# Altium schematic sheet ifamp.SchDoc: IF Amp
size Letter; CheckedBy: J. Brinton; CompanyName: Signal Laboratories, Inc.; DrawnBy: J. Brinton; Engineer: J. Brinton; Address1: 3479 Edison Way; Address2: Menlo Park CA 94025; Address3: +1 (877) 778-8435; Address4: siglabs.com; Revision: 3; SheetNumber: 14; SheetTotal: 45
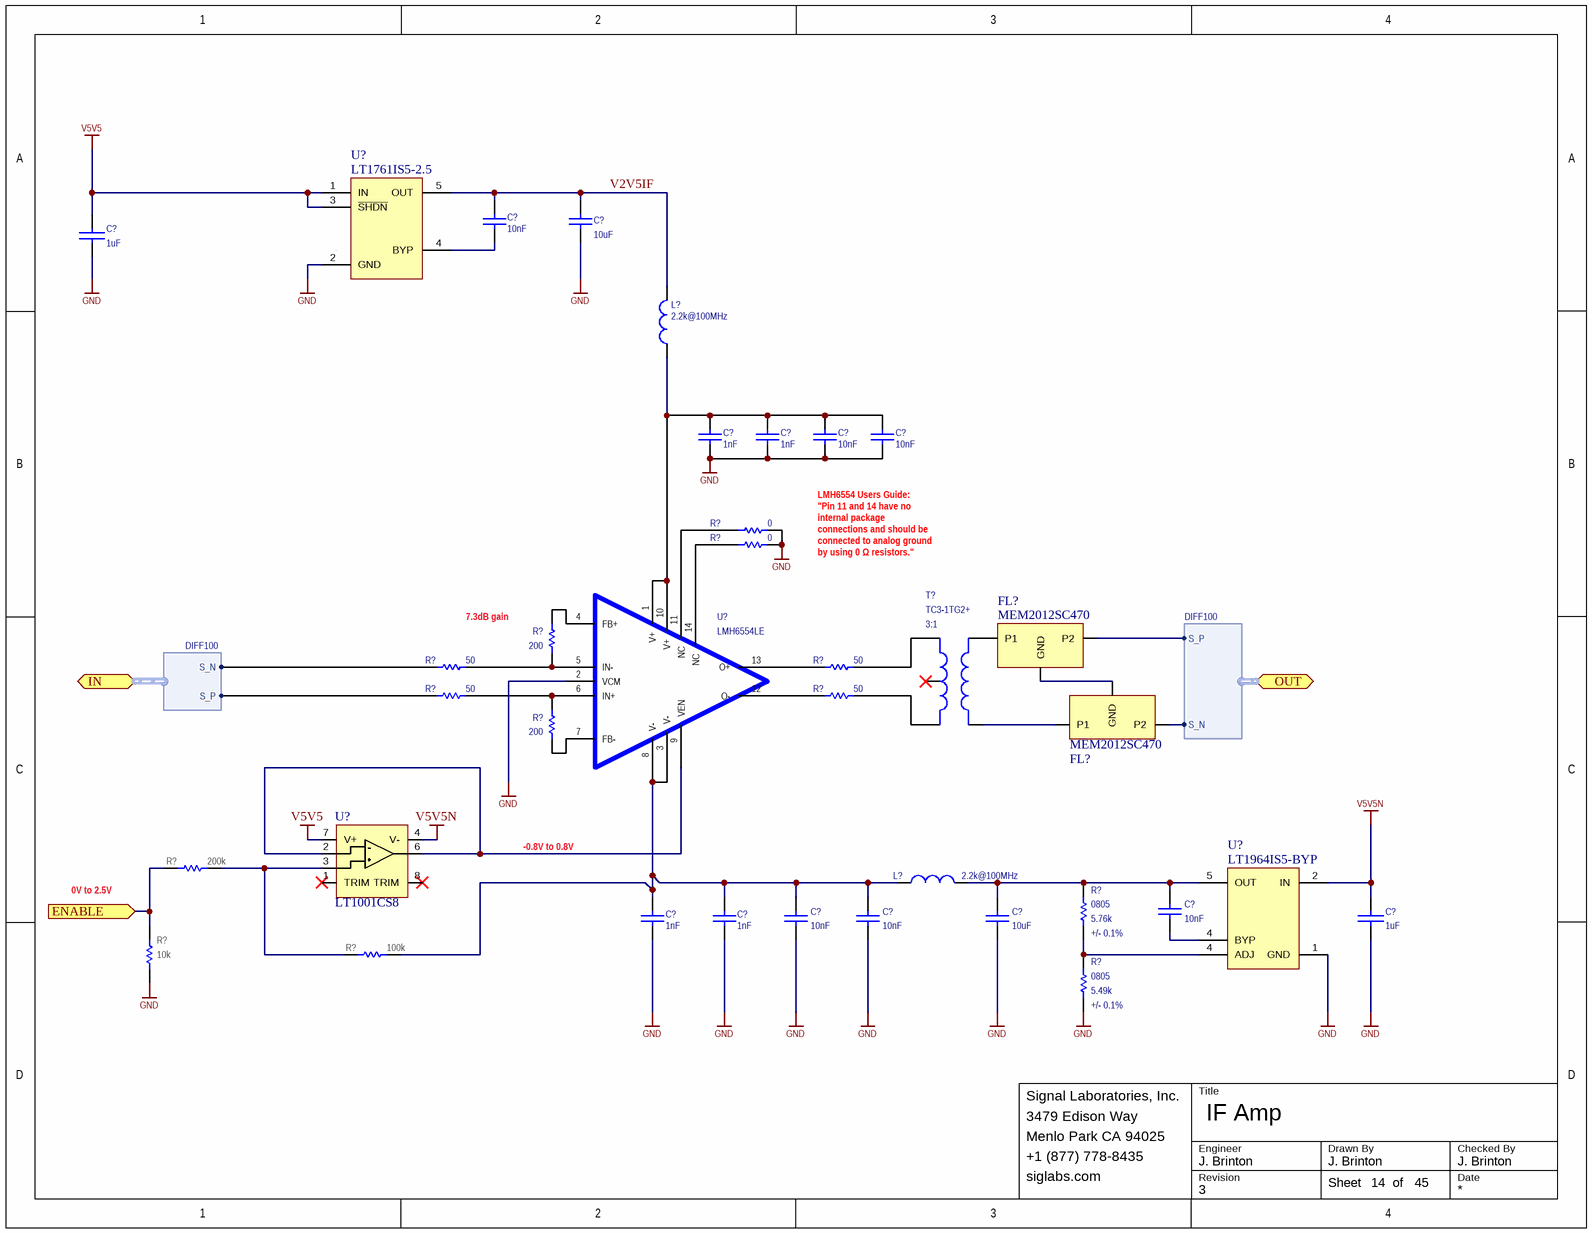
[diagram p0: ifamp.SchDoc]

## Parts
(Parts that share a designator on the sheet are numbered #1, #2 ... from top to bottom, then left to right.)
C?#1  value 10nF  [CAPC100X50X55L25N]  (hidden comment: GRM155R71H103KA88)
C?#2  value 10uF  [0603]  (hidden comment: CL10A106MA8NRNC)
C?#3  value 1uF  [CAPC100X50X55L25N]  (hidden comment: GRM155R61A105KE15D)
C?#4  value 1nF  [CAPC100X50X55L25N]  (hidden comment: GRM155R71H102KA01)
C?#5  value 1nF  [CAPC100X50X55L25N]  (hidden comment: GRM155R71H102KA01)
C?#6  value 10nF  [CAPC100X50X55L25N]  (hidden comment: GRM155R71H103KA88)
C?#7  value 10nF  [CAPC100X50X55L25N]  (hidden comment: GRM155R71H103KA88)
C?#8  value 10nF  [CAPC100X50X55L25N]  (hidden comment: GRM155R71H103KA88)
C?#9  value 1nF  [CAPC100X50X55L25N]  (hidden comment: GRM155R71H102KA01)
C?#10  value 1nF  [CAPC100X50X55L25N]  (hidden comment: GRM155R71H102KA01)
C?#11  value 10nF  [CAPC100X50X55L25N]  (hidden comment: GRM155R71H103KA88)
C?#12  value 10nF  [CAPC100X50X55L25N]  (hidden comment: GRM155R71H103KA88)
C?#13  value 10uF  [0603]  (hidden comment: CL10A106MA8NRNC)
C?#14  value 1uF  [CAPC100X50X55L25N]  (hidden comment: GRM155R61A105KE15D)
FL?#1  MEM2012SC470  [FIL_MEM2012SC470_MEM2012SC470(Primary)]
FL?#2  MEM2012SC470  [FIL_MEM2012SC470_MEM2012SC470(Primary)]
L?#1  value 2.2k@100MHz  [INDC1005X55N]  (hidden comment: MMZ1005A222ET000)
L?#2  value 2.2k@100MHz  [INDC1005X55N]  (hidden comment: MMZ1005A222ET000)
R?#1  value 0  [RESC1005X40N]  (hidden comment: ERJ-2GE0R00X)
R?#2  value 0  [RESC1005X40N]  (hidden comment: ERJ-2GE0R00X)
R?#3  value 200  [RESC1005X40N]  (hidden comment: FC0402E2000BTT0)
R?#4  value 50  [RESC1005X40N]  (hidden comment: FC0402E50R0BST1)
R?#5  value 50  [RESC1005X40N]  (hidden comment: FC0402E50R0BST1)
R?#6  value 50  [RESC1005X40N]  (hidden comment: FC0402E50R0BST1)
R?#7  value 50  [RESC1005X40N]  (hidden comment: FC0402E50R0BST1)
R?#8  value 200  [RESC1005X40N]  (hidden comment: FC0402E2000BTT0)
R?#9  value 200k  [RESC1005X40N]  (hidden comment: ERJ-2RKF2003X)
R?#10  value 5.76k  Tolerance: +/- 0.1%  Package: 0805  [RESC2012X70N]  (hidden comment: RG2012P-5761-B-T5)
R?#11  value 10k  [RESC1005X40N]  (hidden comment: ERJ-2RKF1002X)
R?#12  value 100k  [RESC1005X40N]  (hidden comment: ERJ-2RKF1003X)
R?#13  value 5.49k  Tolerance: +/- 0.1%  Package: 0805  [RESC2012X70N]  (hidden comment: RG2012P-5491-B-T5)
T?  value 3:1  [AT224-1A]  (hidden comment: TC3-1TG2+)
U?#1  LT1761IS5-2.5  [TSOT-5]
U?#2  LMH6554LE  [NHJ0014A]
U?#3  LT1001CS8  [SOIC8]
U?#4  LT1964IS5-BYP  [SOT23-5]

## Ports
ENABLE (in), IN (harness DIFF100), OUT (harness DIFF100)

## Harnesses
DIFF100: S_P, S_N

## Nets
GND: C?#2.1 C?#3.1 C?#4.1 C?#5.1 C?#6.1 C?#7.1 C?#9.1 C?#10.1 C?#11.1 C?#12.1 C?#13.1 C?#14.1 R?#1.2 R?#2.2 R?#11.2 R?#13.1 U?#1.2(GND) U?#2.2(VCM) U?#4.1(GND)
V5V5: C?#3.2 U?#1.1(IN) U?#1.3(~{SHDN}) U?#3.7(V+)
V5V5N: C?#14.2 U?#3.4(V-) U?#4.2(IN)
ENABLE: R?#9.2 R?#11.1 ; port ENABLE
V2V5IF: C?#1.2 C?#2.2 L?#1.2 U?#1.5(OUT)
NetC?#1_1: C?#1.1 U?#1.4(BYP)
NetC?#4_2: C?#4.2 C?#5.2 C?#6.2 C?#7.2 L?#1.1 U?#2.1(V+) U?#2.10(V+)
NetC?#8_1: C?#8.1 U?#4.4(BYP)
NetC?#8_2: C?#8.2 C?#13.2 L?#2.2 R?#10.2 U?#4.5(OUT)
NetC?#9_2: C?#9.2 C?#10.2 C?#11.2 C?#12.2 L?#2.1 R?#12.1 U?#2.3(V-) U?#2.8(V-)
NetFL?#1_1: FL?#1.1(P1) T?.4(Pri-)
NetFL?#1_2_5: FL?#1.2_5(GND) FL?#2.2_5(GND)
NetFL?#1_3: FL?#1.3(P2) ; port OUT.S_P
NetFL?#2_1: FL?#2.1(P1) T?.6(Pri+)
NetFL?#2_3: FL?#2.3(P2) ; port OUT.S_N
NetR?#1_1: R?#1.1 U?#2.11(NC)
NetR?#2_1: R?#2.1 U?#2.14(NC)
NetR?#3_1: R?#3.1 U?#2.4(FB+)
NetR?#3_2: R?#3.2 R?#4.2 U?#2.5(IN-)
NetR?#4_1: R?#4.1 ; port IN.S_N
NetR?#5_1: R?#5.1 U?#2.13(O+)
NetR?#5_2: R?#5.2 T?.3(Sec-)
NetR?#6_1: R?#6.1 ; port IN.S_P
NetR?#6_2: R?#6.2 R?#8.1 U?#2.6(IN+)
NetR?#7_1: R?#7.1 U?#2.12(O-)
NetR?#7_2: R?#7.2 T?.1(Sec+)
NetR?#8_2: R?#8.2 U?#2.7(FB-)
NetR?#9_1: R?#9.1 R?#12.2 U?#3.3(IN+)
NetR?#10_1: R?#10.1 R?#13.2 U?#4.4(ADJ)
NetU?#2_9: U?#2.9(VEN) U?#3.2(IN-) U?#3.6(OUT)

Not connected (* = marked no-connect by the designer): T? 2(SecCT)*; U?#3 1(TRIM)* 5(NC) 8(TRIM)*

## Notes on the sheet
- (near C?#7) LMH6554 Users Guide:
  "Pin 11 and 14 have no internal package connections and should be connected to analog ground by using 0 Ω resistors."
- (near R?#3) 7.3dB gain
- (near R?#11) 0V to 2.5V
- -0.8V to 0.8V
- Title
- Engineer
- Revision
- Drawn By
- Checked By
- Date
- Sheet
- of

## Library data of the parts
C?#1 C?#6-C?#8 C?#11 C?#12 = CAP 0402: Ceramic Capacitor 10nF ±10% 50V X7R 0402; Manufacturer: Murata; Tr: -55:125; Voltage: 50V; Manufacturer P/N: GRM155R71H103KA88; Package: 0402; Tolerance: ±10%
C?#2 C?#13 = CAP 0603: Ceramic Capacitor 10uF ±20% 25V X5R 0603; Manufacturer: Samsung; Tr: -55:85; Manufacturer P/N: CL10A106MA8NRNC; Voltage: 25V; Package: 0603; Tolerance: ±20%
C?#3 C?#14 = CAP: Ceramic Capacitor 1uF ±10% 10V X5R 0402; Manufacturer: Murata; Tr: -55:125; Manufacturer P/N: GRM155R61A105KE15D; Package: 0402; Tolerance: ±10%; Voltage: 10V
C?#4 C?#5 C?#9 C?#10 = CAP 0402: Ceramic Capacitor 1nF ±10% 50V X7R 0402; Manufacturer: Murata; Tolerance: ±5%; Tr: -55:125; Voltage: 50V; Manufacturer P/N: GRM155R71H102KA01; Package: CAPC100X50X55L25N
FL?#1 FL?#2 = MEM2012SC470: EMI Filter 1A 12V Flat Style SMD Punched Paper T/R; MF: TDK; Package: 0805 TDK; MP: MEM2012SC470; Availability: Good; Price: 0.30 USD; SnapEDA_Link: https://www.snapeda.com/symbols-footprints/MEM2012SC470/TDK/view-part/?ref=snap; Value: *
L?#1 L?#2 = INDUCTANCE1: Ferrite Bead 2.2k@100MHz 150mA 0402; Manufacturer: TDK; Tr: -55:125; Manufacturer P/N: MMZ1005A222ET000; Package: 0402
R?#1 R?#2 = RES 0402: Thick Film Resistor Jumper 0402; Manufacturer: Panasonic; Tr: -55:155; Package: 0402; Manufacturer P/N: ERJ-2GE0R00X; Tolerance: 0
R?#3 R?#8 = RES 0603: Thin Film RF Resistor 200 Ohm ±0.1% 0402; Manufacturer: Vishay; Tr: -55:155; Package: 0402; Manufacturer P/N: FC0402E2000BTT0; Do Not Place: *; Tolerance: ±0.1%
R?#4-R?#7 = RES 0603: Thin Film RF Resistor 50 Ohm ±0.1% 0402; Manufacturer: Vishay; Tr: -55:155; Package: 0402; Manufacturer P/N: FC0402E50R0BST1; Do Not Place: *; Tolerance: ±0.1%
R?#9 = RES: Thick Film Resistor 200k ±1% 0.1W 50V 0402; Manufacturer: Panasonic; Tcr: ±100; Tr: -55:155; Voltage: 50; Power: 0.1; Manufacturer P/N: ERJ-2RKF2003X; Tolerance: ±1%; Alternatives: *; Footprint: *; Package: 0402
R?#10 = RES: Thin Film Resistor 5.76k +/-0.1% SMD 0805; Manufacturer: Susumu; Tr: -55:155; Tcr: *; Manufacturer P/N: RG2012P-5761-B-T5; Alternatives: *; Voltage: *; Power: *
R?#11 = RES: Thick Film Resistor 10k ±1% 0.1W 50V 0402; Manufacturer: Panasonic; Tcr: ±100; Tr: -55:155; Voltage: 50; Power: 0.1; Manufacturer P/N: ERJ-2RKF1002X; Tolerance: ±1%; Alternatives: *; Footprint: *; Package: 0402
R?#12 = RES: Thick Film Resistor 100k ±1% 0.1W 50V 0402; Manufacturer: Panasonic; Tcr: ±100; Tr: -55:155; Voltage: 50; Power: 0.1; Manufacturer P/N: ERJ-2RKF1003X; Tolerance: ±1%; Alternatives: *; Footprint: *; Package: 0402
R?#13 = RES: Thin Film Resistor 5.49k +/-0.1% SMD 0805; Manufacturer: Susumu; Tr: -55:155; Tcr: *; Manufacturer P/N: RG2012P-5491-B-T5; Alternatives: *; Voltage: *; Power: *
T? = TC1-1TG2+: RF Transformer 0.4 to 500MHz SMD; Manufacturer: Mini-Circuits; Manufacturer P/N: TC3-1TG2+
U?#1 = LT1761IS5-5: 100mA Low Noise LDO 5V; Manufacturer: Linear Technologies; Manufacturer P/N: LT1761IS5-5
U?#2 = LMH6554LE: 2.8 GHz Ultra Linear Fully Differential Amplifier; Manufacturer: Texas Instruments; Manufacturer P/N: LMH6554LE
U?#3 = LT1001CS8: Precision Operational Amplifier; Manufacturer: Linear Technologies; Manufacturer P/N: LT1001CS8
U?#4 = LT1964IS5-BYP: 200mA Low Noise negative-LDO; Manufacturer: Linear Technologies; Manufacturer P/N: LT1964IS5-BYP